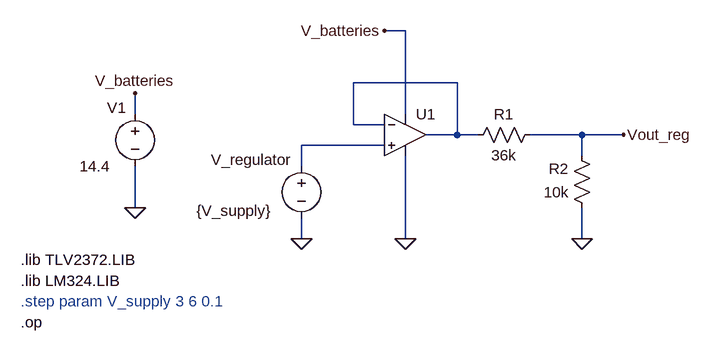
[diagram p0: schematic voltage_meaurementSINGLEregulator.asc]
voltage_meaurementSINGLEregulator.asc, the LTspice schematic file:
Version 4
SHEET 1 924 680
WIRE 368 -48 336 -48
WIRE 448 32 288 32
WIRE -48 80 -48 48
WIRE 368 80 368 -48
WIRE 288 96 288 32
WIRE 336 96 288 96
WIRE 448 112 448 32
WIRE 448 112 400 112
WIRE 480 112 448 112
WIRE 640 112 560 112
WIRE 704 112 640 112
WIRE 336 128 208 128
WIRE 640 144 640 112
WIRE 208 160 208 128
WIRE -48 224 -48 160
WIRE 208 272 208 240
WIRE 368 272 368 144
WIRE 640 272 640 224
FLAG 704 112 Vout_reg
FLAG 336 -48 V_batteries
FLAG 368 272 0
FLAG -48 224 0
FLAG 640 272 0
FLAG -48 48 V_batteries
FLAG 208 272 0
SYMBOL res 576 96 R90
WINDOW 0 0 56 VBottom 2
WINDOW 3 32 56 VTop 2
SYMATTR InstName R1
SYMATTR Value 36k
SYMATTR SpiceLine tol=1 pwr=0.6
SYMBOL res 656 240 R180
WINDOW 0 36 76 Left 2
WINDOW 3 36 40 Left 2
SYMATTR InstName R2
SYMATTR Value 10k
SYMATTR SpiceLine tol=1 pwr=0.6
SYMBOL OpAmps\\opamp2 368 48 R0
WINDOW 3 16 96 Invisible 2
SYMATTR InstName U1
SYMATTR Value2 LM324
SYMBOL voltage -48 64 R0
WINDOW 0 -14 6 Right 2
WINDOW 3 -85 96 Left 2
WINDOW 123 0 0 Left 0
WINDOW 39 0 0 Left 0
SYMATTR InstName V1
SYMATTR Value 14.4
SYMBOL voltage 208 144 R0
WINDOW 0 -14 6 Right 2
WINDOW 3 -161 85 Left 2
WINDOW 123 0 0 Left 0
WINDOW 39 0 0 Left 0
SYMATTR InstName V_regulator
SYMATTR Value {V_supply}
TEXT -224 368 Left 2 ;.step param V_supply 3 6 0.1
TEXT -224 304 Left 2 !.lib TLV2372.LIB
TEXT -224 336 Left 2 !.lib LM324.LIB
TEXT -224 400 Left 2 !.op

The netlist it stands for:
* voltage_meaurementSINGLEregulator.asc
R1 Vout_reg N001 36k tol=1 pwr=0.6
R2 0 Vout_reg 10k tol=1 pwr=0.6
XU1 N002 N001 V_batteries 0 N001 opamp2 LM324  ; pins In+ In- V+ V- OUT
V1 V_batteries 0 14.4
V_regulator N002 0 {V_supply}
* .step param V_supply 3 6 0.1
.lib TLV2372.LIB
.lib LM324.LIB
.op
.backanno
.end